# Altium schematic sheet Power-Supply.SchDoc
size A4; Date: 27.05.2014; DrawnBy: luths8; Organization: BFH; Address1: Bern University of Applied Sciences; Address2: Engineering and Information Technology; Address3: Jlcoweg 1; Address4: CH-3400 Burgdorf; DocumentNumber: 1; Revision: 1.1; SheetNumber: 1; SheetTotal: 1; CurrentDate: 27.05.2014
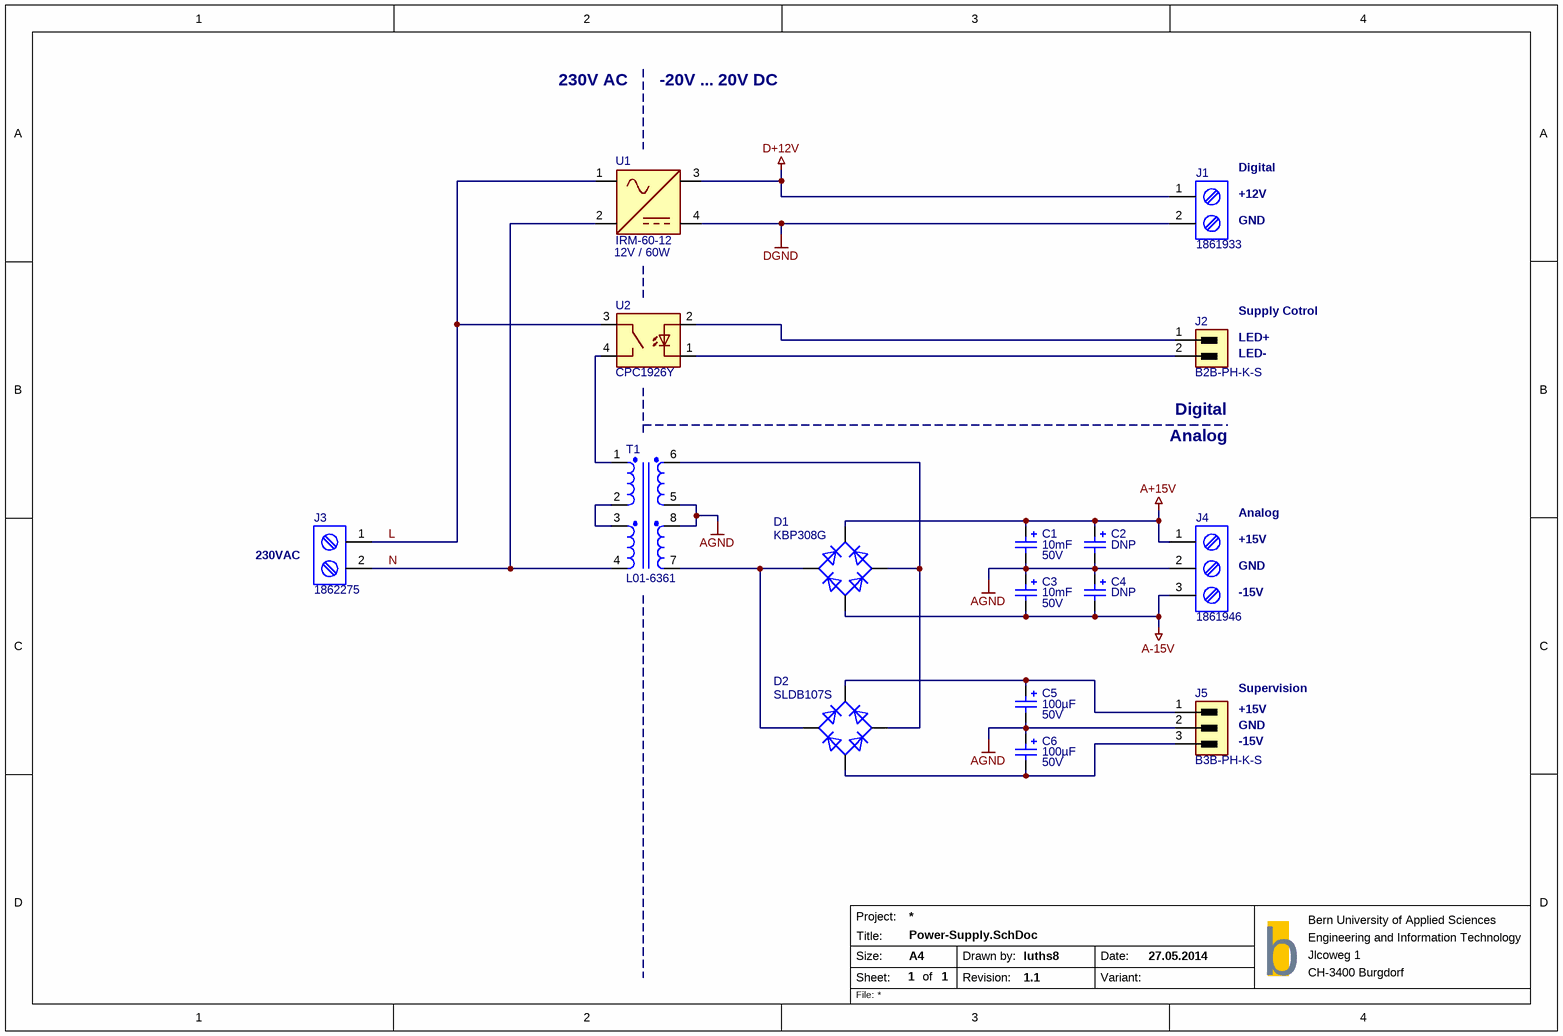
[diagram p0: Power-Supply.SchDoc]

## Parts
C1  10mF  Voltage: 50V  [CAP-25-50-12.5 - duplicate]
C2  DNP  [CAP-25-50-12.5 - duplicate]
C3  10mF  Voltage: 50V  [CAP-25-50-12.5 - duplicate]
C4  DNP  [CAP-25-50-12.5 - duplicate]
C5  100µF  Voltage: 50V  [CAP-8-11.5-3.5]
C6  100µF  Voltage: 50V  [CAP-8-11.5-3.5]
D1  KBP308G  [KBP30]
D2  SLDB107S  [SLDBS-4]
J1  1861933  [1861933]
J2  B2B-PH-K-S  [B2B-PH-K-S]
J3  1862275  [1862275]
J4  1861946  [1861946]
J5  B3B-PH-K-S  [B3B-PH-K-S]
T1  L01-6361  [L01-6364]
U1  IRM-60-12  Power: 12V / 60W  [IRM-606x]
U2  CPC1926Y  [CPC1926Y]

## Nets
A+15V: C1.P C2.P D1.1 J4.1
A-15V: C3.M(q) C4.M(q) D1.4 J4.3
AGND: C1.M(q) C2.M(q) C3.P C4.P C5.M(q) C6.P J4.2 J5.2 T1.5 T1.8
D+12V: J1.1 U1.3(V+)
DGND: J1.2 U1.4(GND)
L: J3.1 U1.1(AC) U2.3
N: J3.2 T1.4 U1.2(AC)
NetC5_P: C5.P D2.1 J5.1
NetC6_M: C6.M(q) D2.4 J5.3
NetD1_2: D1.2 D2.2 T1.7
NetD1_3: D1.3 D2.3 T1.6
NetJ2_1: J2.1 U2.2
NetJ2_2: J2.2 U2.1
NetT1_1: T1.1 U2.4
NetT1_2: T1.2 T1.3

## Notes on the sheet
- 230V AC
- -20V ... 20V DC
- (near J1) Digital
- (near J1) +12V
- (near J1) GND
- (near J2) Supply Cotrol
- (near J2) LED+
- (near J2) LED-
- Analog
- (near J2) Digital
- (near J4) Analog
- (near J3) 230VAC
- (near J4) +15V
- (near J4) GND
- (near J4) -15V
- (near J5) +15V
- (near J5) Supervision
- (near J5) GND
- (near J5) -15V
- Project:
- Size:
- Sheet:
- Title:
- A4
- of
- Drawn by:
- Revision:
- Date:
- Variant:
- b
- File:

## Library data of the parts
C1 C3 = Capacitor Electrolytic: Elektrolytic Capacitor; Manufacturer Part No.: UKW1H103MRD
C2 C4 = Capacitor Electrolytic: Elektrolytic Capacitor; Manufacturer Part No.: UKW1H103MRD; Voltage: 50V
C5 C6 = Capacitor Electrolytic: Elektrolytic Capacitor; Manufacturer Part No.: EEU-FR1H101
D1 D2 = Rectifier: Full Bridge Rectifier
  D1: Manufacturer Part No.: KBP308G
  D2: Manufacturer Part No.: SLDB107S
J1 = 1861933: Screw Terminal, 2 Position; System: Connector; Manufacturer Part No.: 1861933
J2 = Connector 2x1P: Manufacturer Part No.: B2B-PH-K-S; System: Connector
J3 = 1862275: Screw Terminal, 2 Position, 5mm Spacing; System: Connector; Manufacturer Part No.: 1862275
J4 = 1861946: Screw Terminal, 3 Position; System: Connector; Manufacturer Part No.: 1861946
J5 = Connector 3x1P: Manufacturer Part No.: B2B-PH-K-S; System: Connector
T1 = Transformer: Manufacturer Part No.: L01-6361
U1 = ACDC Converter: AC/DC Converter (100VAC - 240VAC to 5VDC); Manufacturer Part No.: IRM-60-12
U2 = OptoMOS SSR: OptoMOS Solid State Relay